# Altium schematic sheet 4_ZynTra-Zynq-PS.SchDoc
size 457 x 266 mm; SheetNumber: 4; SheetTotal: 10
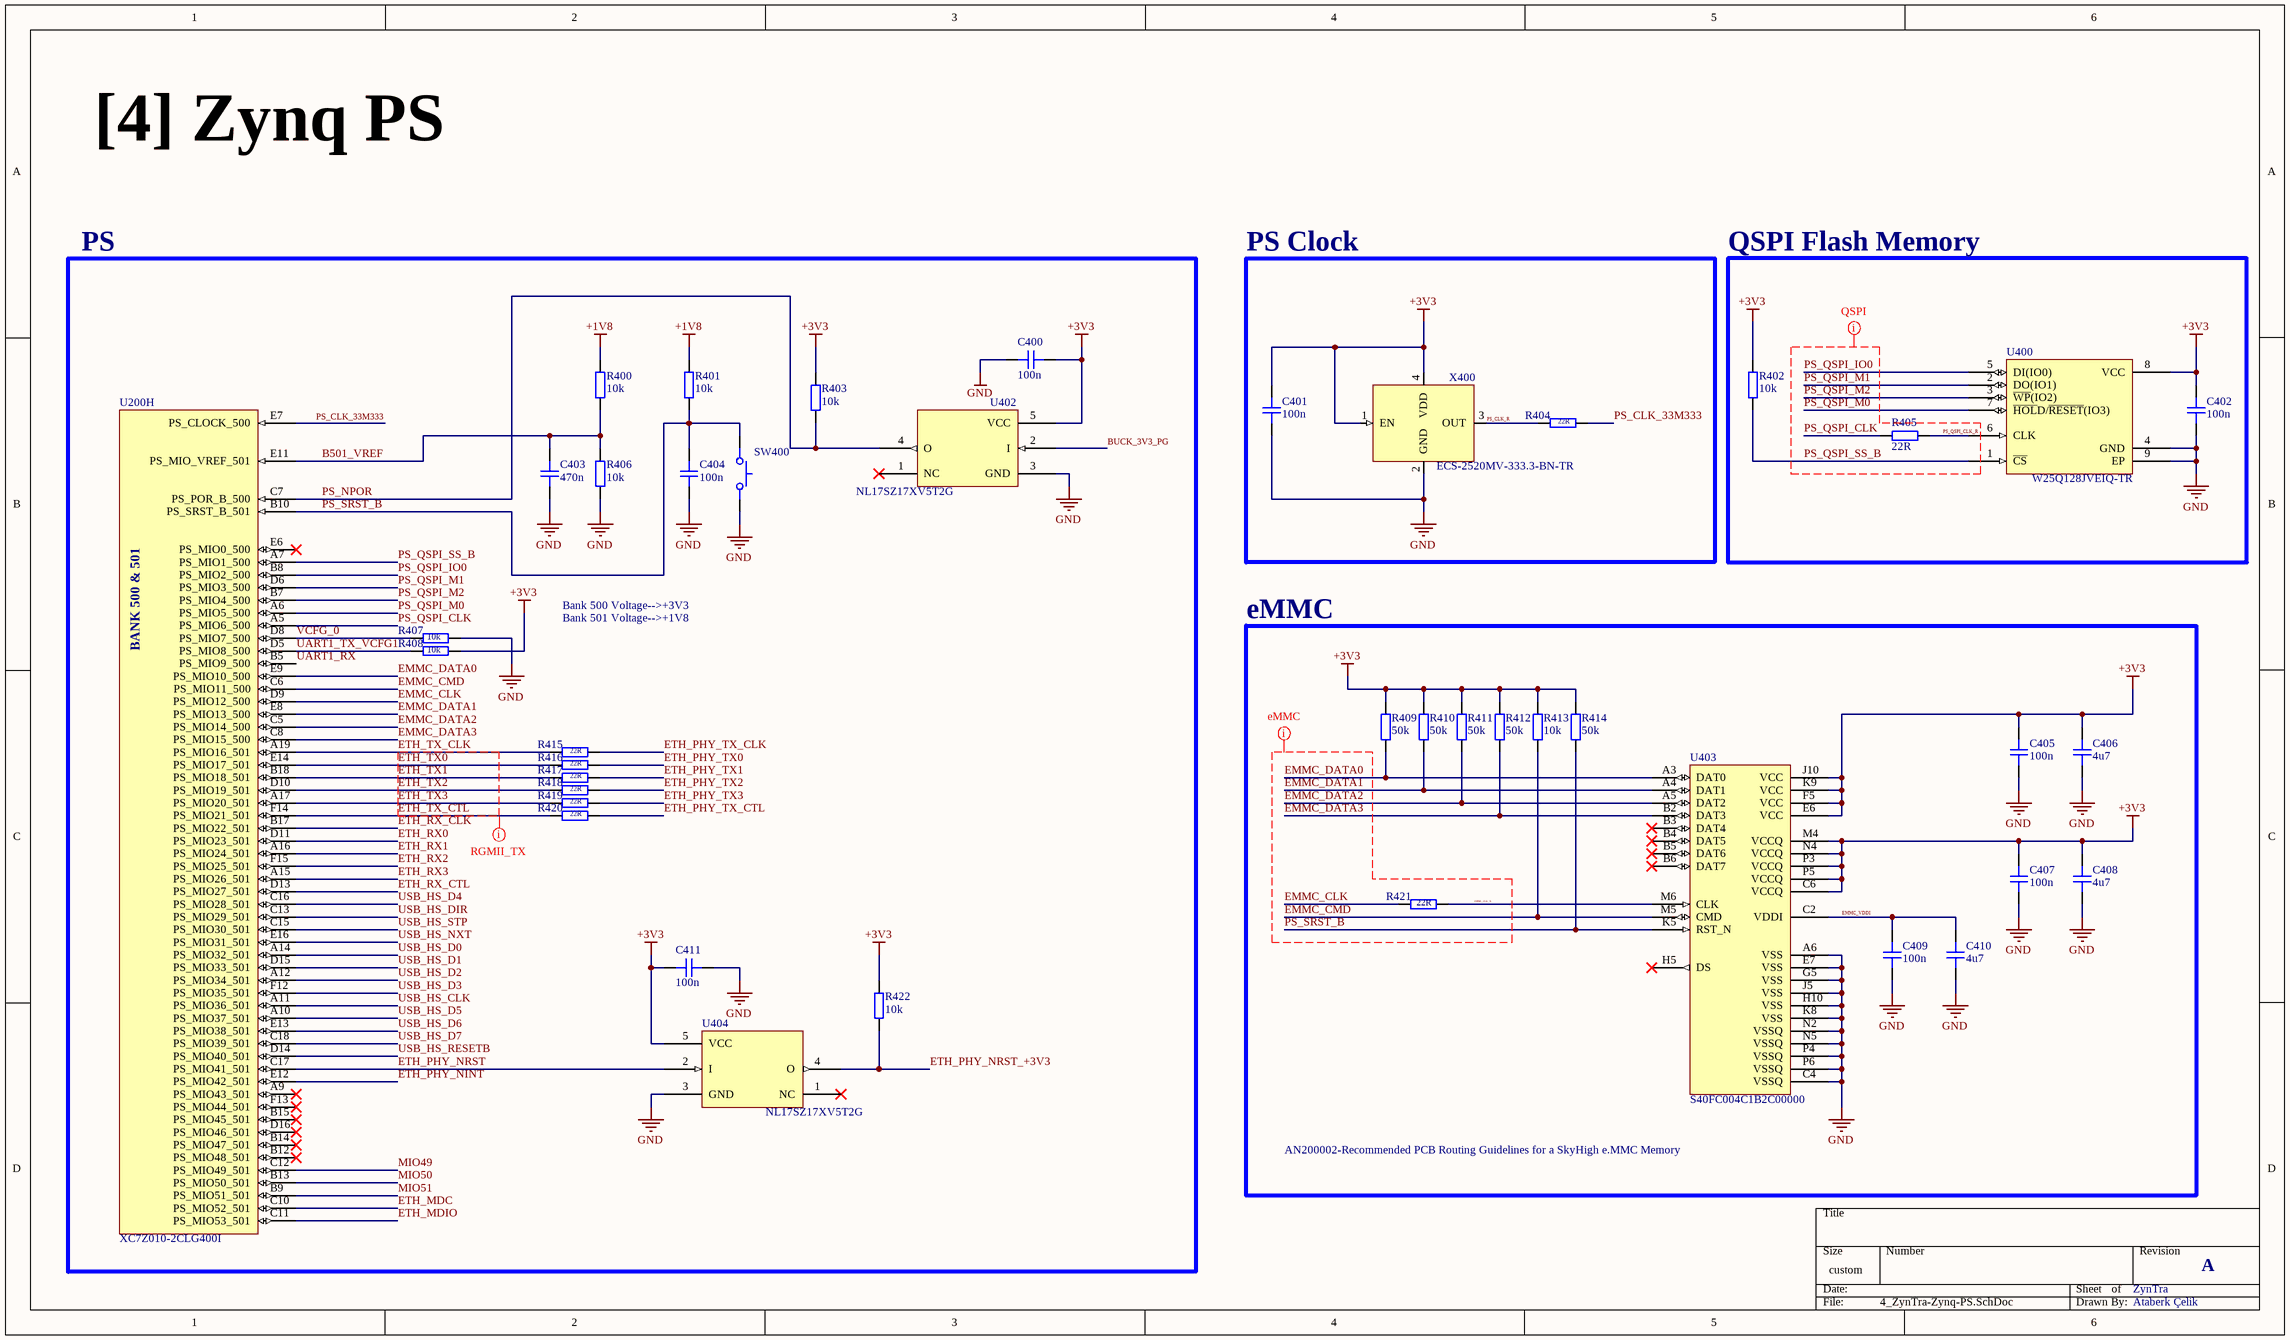
[diagram p0: 4_ZynTra-Zynq-PS.SchDoc]

## Parts
C400  100n  [CAP_0201]
C401  100n  [CAP_0201]
C402  100n  [CAP_0201]
C403  470n  [CAP_0201]
C404  100n  [CAP_0201]
C405  100n  [CAP_0201]
C406  4u7  [CAP_0402]
C407  100n  [CAP_0201]
C408  4u7  [CAP_0402]
C409  100n  [CAP_0201]
C410  4u7  [CAP_0402]
C411  100n  [CAP_0201]
R400  10k  [RES_0402]
R401  10k  [RES_0402]
R402  10k  [RES_0402]
R403  10k  [RES_0402]
R404  22R  [RES_0402]
R405  22R  [RES_0402]
R406  10k  [RES_0402]
R407  10k  [RES_0402]
R408  10k  [RES_0402]
R409  50k  [RES_0402]
R410  50k  [RES_0402]
R411  50k  [RES_0402]
R412  50k  [RES_0402]
R413  10k  [RES_0402]
R414  50k  [RES_0402]
R415  22R  [RES_0402]
R416  22R  [RES_0402]
R417  22R  [RES_0402]
R418  22R  [RES_0402]
R419  22R  [RES_0402]
R420  22R  [RES_0402]
R421  22R  [RES_0402]
R422  10k  [RES_0402]
SW400  SKRPANE010  [SKRPANE010]  (value not drawn)
U200  XC7Z010-2CLG400I  [CLG400, 0.8mm, 17x17]  (part H of 9)
U400  W25Q128JVEIQ-TR  [WSON8, 8x6mm]
U402  NL17SZ17XV5T2G  [SOTFL553, 5 ,1.60x1.20mm]
U403  S40FC004C1B2C00000  [VFBGA-153, 9.00x7.50mm]
U404  NL17SZ17XV5T2G  [SOTFL553, 5 ,1.60x1.20mm]
X400  ECS-2520MV-333.3-BN-TR  [XTAL_2520]

## Blocks framed on the sheet
PS: C400 C403 C404 C411 R400 R401 R403 R406-R408 R415-R420 R422 SW400 U200 U402 U404
PS Clock: C401 R404 X400
QSPI Flash Memory: C402 R402 R405 U400
eMMC: C405-C410 R409-R414 R421 U403

## Nets
+1V8: R400.1 R401.1
+3V3: C400.1 C401.2 C402.1 C405.2 C406.2 C407.2 C408.2 C411.2 R402.1 R403.1 R408.2 R409.1 R410.1 R411.1 R412.1 R413.1 R414.1 R422.1 U400.8(VCC) U402.5(VCC) U403.C6(VCCQ) U403.E6(VCC) U403.F5(VCC) U403.J10(VCC) U403.K9(VCC) U403.M4(VCCQ) U403.N4(VCCQ) U403.P3(VCCQ) U403.P5(VCCQ) U404.5(VCC) X400.1(EN) X400.4(VDD)
GND: C400.2 C401.1 C402.2 C403.1 C404.1 C405.1 C406.1 C407.1 C408.1 C409.1 C410.1 C411.1 R406.2 R407.2 SW400.34 U400.4(GND) U400.9(EP) U402.3(GND) U403.A6(VSS) U403.C4(VSSQ) U403.E7(VSS) U403.G5(VSS) U403.H10(VSS) U403.J5(VSS) U403.K8(VSS) U403.N2(VSSQ) U403.N5(VSSQ) U403.P4(VSSQ) U403.P6(VSSQ) U404.3(GND) X400.2(GND)
B501_VREF: C403.2 R400.2 R406.1 U200.E11(PS_MIO_VREF_501)
BUCK_3V3_PG: U402.2(I)
EMMC_CLK: R421.2 U200.D9(PS_MIO12_500)
EMMC_CLK_R: R421.1 U403.M6(CLK)
EMMC_CMD: R413.2 U200.C6(PS_MIO11_500) U403.M5(CMD)
EMMC_DATA0: R409.2 U200.E9(PS_MIO10_500) U403.A3(DAT0)
EMMC_DATA1: R410.2 U200.E8(PS_MIO13_500) U403.A4(DAT1)
EMMC_DATA2: R411.2 U200.C5(PS_MIO14_500) U403.A5(DAT2)
EMMC_DATA3: R412.2 U200.C8(PS_MIO15_500) U403.B2(DAT3)
EMMC_VDDI: C409.2 C410.2 U403.C2(VDDI)
ETH_MDC: U200.C10(PS_MIO52_501)
ETH_MDIO: U200.C11(PS_MIO53_501)
ETH_PHY_NINT: U200.E12(PS_MIO42_501)
ETH_PHY_NRST: U200.C17(PS_MIO41_501) U404.2(I)
ETH_PHY_NRST_+3V3: R422.2 U404.4(O)
ETH_PHY_TX0: R416.1
ETH_PHY_TX1: R417.1
ETH_PHY_TX2: R418.1
ETH_PHY_TX3: R419.1
ETH_PHY_TX_CLK: R415.1
ETH_PHY_TX_CTL: R420.1
ETH_RX0: U200.D11(PS_MIO23_501)
ETH_RX1: U200.A16(PS_MIO24_501)
ETH_RX2: U200.F15(PS_MIO25_501)
ETH_RX3: U200.A15(PS_MIO26_501)
ETH_RX_CLK: U200.B17(PS_MIO22_501)
ETH_RX_CTL: U200.D13(PS_MIO27_501)
ETH_TX0: R416.2 U200.E14(PS_MIO17_501)
ETH_TX1: R417.2 U200.B18(PS_MIO18_501)
ETH_TX2: R418.2 U200.D10(PS_MIO19_501)
ETH_TX3: R419.2 U200.A17(PS_MIO20_501)
ETH_TX_CLK: R415.2 U200.A19(PS_MIO16_501)
ETH_TX_CTL: R420.2 U200.F14(PS_MIO21_501)
MIO49: U200.C12(PS_MIO49_501)
MIO50: U200.B13(PS_MIO50_501)
MIO51: U200.B9(PS_MIO51_501)
PS_CLK_33M333: R404.1 U200.E7(PS_CLOCK_500)
PS_CLK_R: R404.2 X400.3(OUT)
PS_NPOR: R403.2 U200.C7(PS_POR_B_500) U402.4(O)
PS_QSPI_CLK: R405.2 U200.A5(PS_MIO6_500)
PS_QSPI_CLK_R: R405.1 U400.6(CLK)
PS_QSPI_IO0: U200.B8(PS_MIO2_500) U400.5(DI(IO0))
PS_QSPI_M0: U200.A6(PS_MIO5_500) U400.7(~{HOL}D/~{RESET}(IO3))
PS_QSPI_M1: U200.D6(PS_MIO3_500) U400.2(DO(IO1))
PS_QSPI_M2: U200.B7(PS_MIO4_500) U400.3(~{WP}(IO2))
PS_QSPI_SS_B: R402.2 U200.A7(PS_MIO1_500) U400.1(~{CS})
PS_SRST_B: C404.2 R401.2 R414.2 SW400.12 U200.B10(PS_SRST_B_501) U403.K5(RST_N)
UART1_RX: U200.B5(PS_MIO9_500)
UART1_TX_VCFG1: R408.1 U200.D5(PS_MIO8_500)
USB_HS_CLK: U200.A11(PS_MIO36_501)
USB_HS_D0: U200.A14(PS_MIO32_501)
USB_HS_D1: U200.D15(PS_MIO33_501)
USB_HS_D2: U200.A12(PS_MIO34_501)
USB_HS_D3: U200.F12(PS_MIO35_501)
USB_HS_D4: U200.C16(PS_MIO28_501)
USB_HS_D5: U200.A10(PS_MIO37_501)
USB_HS_D6: U200.E13(PS_MIO38_501)
USB_HS_D7: U200.C18(PS_MIO39_501)
USB_HS_DIR: U200.C13(PS_MIO29_501)
USB_HS_NXT: U200.E16(PS_MIO31_501)
USB_HS_RESETB: U200.D14(PS_MIO40_501)
USB_HS_STP: U200.C15(PS_MIO30_501)
VCFG_0: R407.1 U200.D8(PS_MIO7_500)

Not connected (* = marked no-connect by the designer): U200 A9(PS_MIO43_501)* B12(PS_MIO48_501)* B14(PS_MIO47_501)* B15(PS_MIO45_501)* D16(PS_MIO46_501)* E6(PS_MIO0_500)* F13(PS_MIO44_501)*; U402 1(NC)*; U403 B3(DAT4)* B4(DAT5)* B5(DAT6)* B6(DAT7)* H5(DS)*; U404 1(NC)*

## Layout directives
net class QSPI; rule Matched Net Lengths [Delay Tolerance = 10ps]: PS_QSPI_CLK, PS_QSPI_CLK_R, PS_QSPI_IO0, PS_QSPI_M0, PS_QSPI_M1, PS_QSPI_M2, PS_QSPI_SS_B
net class EMMC; rule Matched Net Lengths [Delay Tolerance = 10ps]: EMMC_CLK, EMMC_CLK_R, EMMC_CMD, EMMC_DATA0, EMMC_DATA1, EMMC_DATA2, EMMC_DATA3, PS_SRST_B
net class RGMII_TX; rule Matched Net Lengths [Delay Tolerance = 1ps]: ETH_TX_CTL

## Notes on the sheet
- [4] Zynq PS
- Bank 500 Voltage-->+3V3
- Bank 501 Voltage-->+1V8
- AN200002-Recommended PCB Routing Guidelines for a SkyHigh e.MMC Memory
- ZynTra
- A
- Ataberk Çelik
- (in symbol XC7Z010-2CLG400I, part H) BANK 500 & 501

## Library data of the parts
C400-C405 C407 C409 C411 = CAP_0201: Capacitor SMD 0201; Manufacturer: *; Manufacturer Part Number: *; Distributor Link: *; LCSC: *; Rating: *; Dielectric: *
C406 C408 C410 = CAP_0402: Capacitor SMD 0402; Manufacturer: *; Manufacturer Part Number: *; Distributor Link: *; LCSC: *; Rating: *; Dielectric: *
R400-R422 = RES_0402: Resistor SMD 0402; Manufacturer: *; Manufacturer Part Number: *; Distributor Link: *; LCSC: *
SW400 = SKRPANE010: Tactile Switch SMD SPST; Manufacturer: Alps Alpine; Manufacturer Part Number: SKRPANE010
U200 = XC7Z010-2CLG400I: Zynq 7000S SoC devices feature a single-core Arm® Cortex®-A9 processor mated with 28 nm AMD Artix™ 7 based programmable logic, representing a low cost entry point to the scalable Zynq 7000 platform. Available with 6.25 Gb/s transceivers and outfitted with commonly used hardened peripherals, the Zynq 7000S delivers cost-optimized system integration ideal for industrial IoT applications such as motor control and embedded vision.; Manufacturer: AMD / Xilinx; Manufacturer Part Number: XC7Z010-2CLG400I; Supplier Link: https://www.mouser.com.tr/ProductDetail/AMD-Xilinx/XC7Z010-2CLG400I?qs=rrS6PyfT74cETvLeyRFHTA%3D%3D
U400 = W25Q128JVEIQ-TR: 3V 128M-BIT / SERIAL FLASH MEMORY WITH / DUAL/QUAD SPI; Manufacturer: Winbond; Manufacturer Part Number: W25Q128JVEIQ TR; Supplier Link: https://www.lcsc.com/product-detail/C2456297.html?s_z=n_W25Q128JVEIQ-TR&spm=wm.ssy.bg.0.xh&lcsc_vid=TlhdUFxUFlMPVQBfQVRXA1RWFlhcUlVfT1JaVgVWRwcxVlNRQlBYVVxUR1ReVTsOAxUeFF5JWBYZEEoKFBINSQcJGk4eFQsCAgIaFA%3D%3D
U402 U404 = NL17SZ17XV5T2G: Single Non‐Inverting Buffer / with Schmitt Trigger; Manufacturer: onsemi; Manufacturer Part Number: NL17SZ17XV5T2G; Supplier Link: https://www.mouser.com.tr/ProductDetail/onsemi/NL17SZ17XV5T2G?qs=8sOby8ZxZLFGwooP35NEMQ%3D%3D
U403 = S40FC004C1B2C00000: 4GB, 3.3 V, e.MMC Flash; Manufacturer: SkyHigh Memory; Manufacturer Part Number: S40FC004C1B2C00000; Supplier Link: https://www.mouser.com.tr/ProductDetail/SkyHigh-Memory/S40FC004C1B2C00000?qs=OlC7AqGiEDnnqQ4BF5kidg%3D%3D
X400 = ECS-2520MV-130-BN-TR: Standard Clock Oscillators XO (Standard),13MHz,Standby (Power Down),CMOS, Multi-Volt,1.6 V 3.6 V,+/-50ppm,-40 C 85 C,6mA,Surface Mount,4-SMD, No Lead,(2.50mm x 2.00mm),(0.80mm); Manufacturer: ECS; Manufacturer Part Number: ECS-2520MV-130-BN-TR